# EAGLE design NodeCallerId.cg2 (EAGLE 4.16)
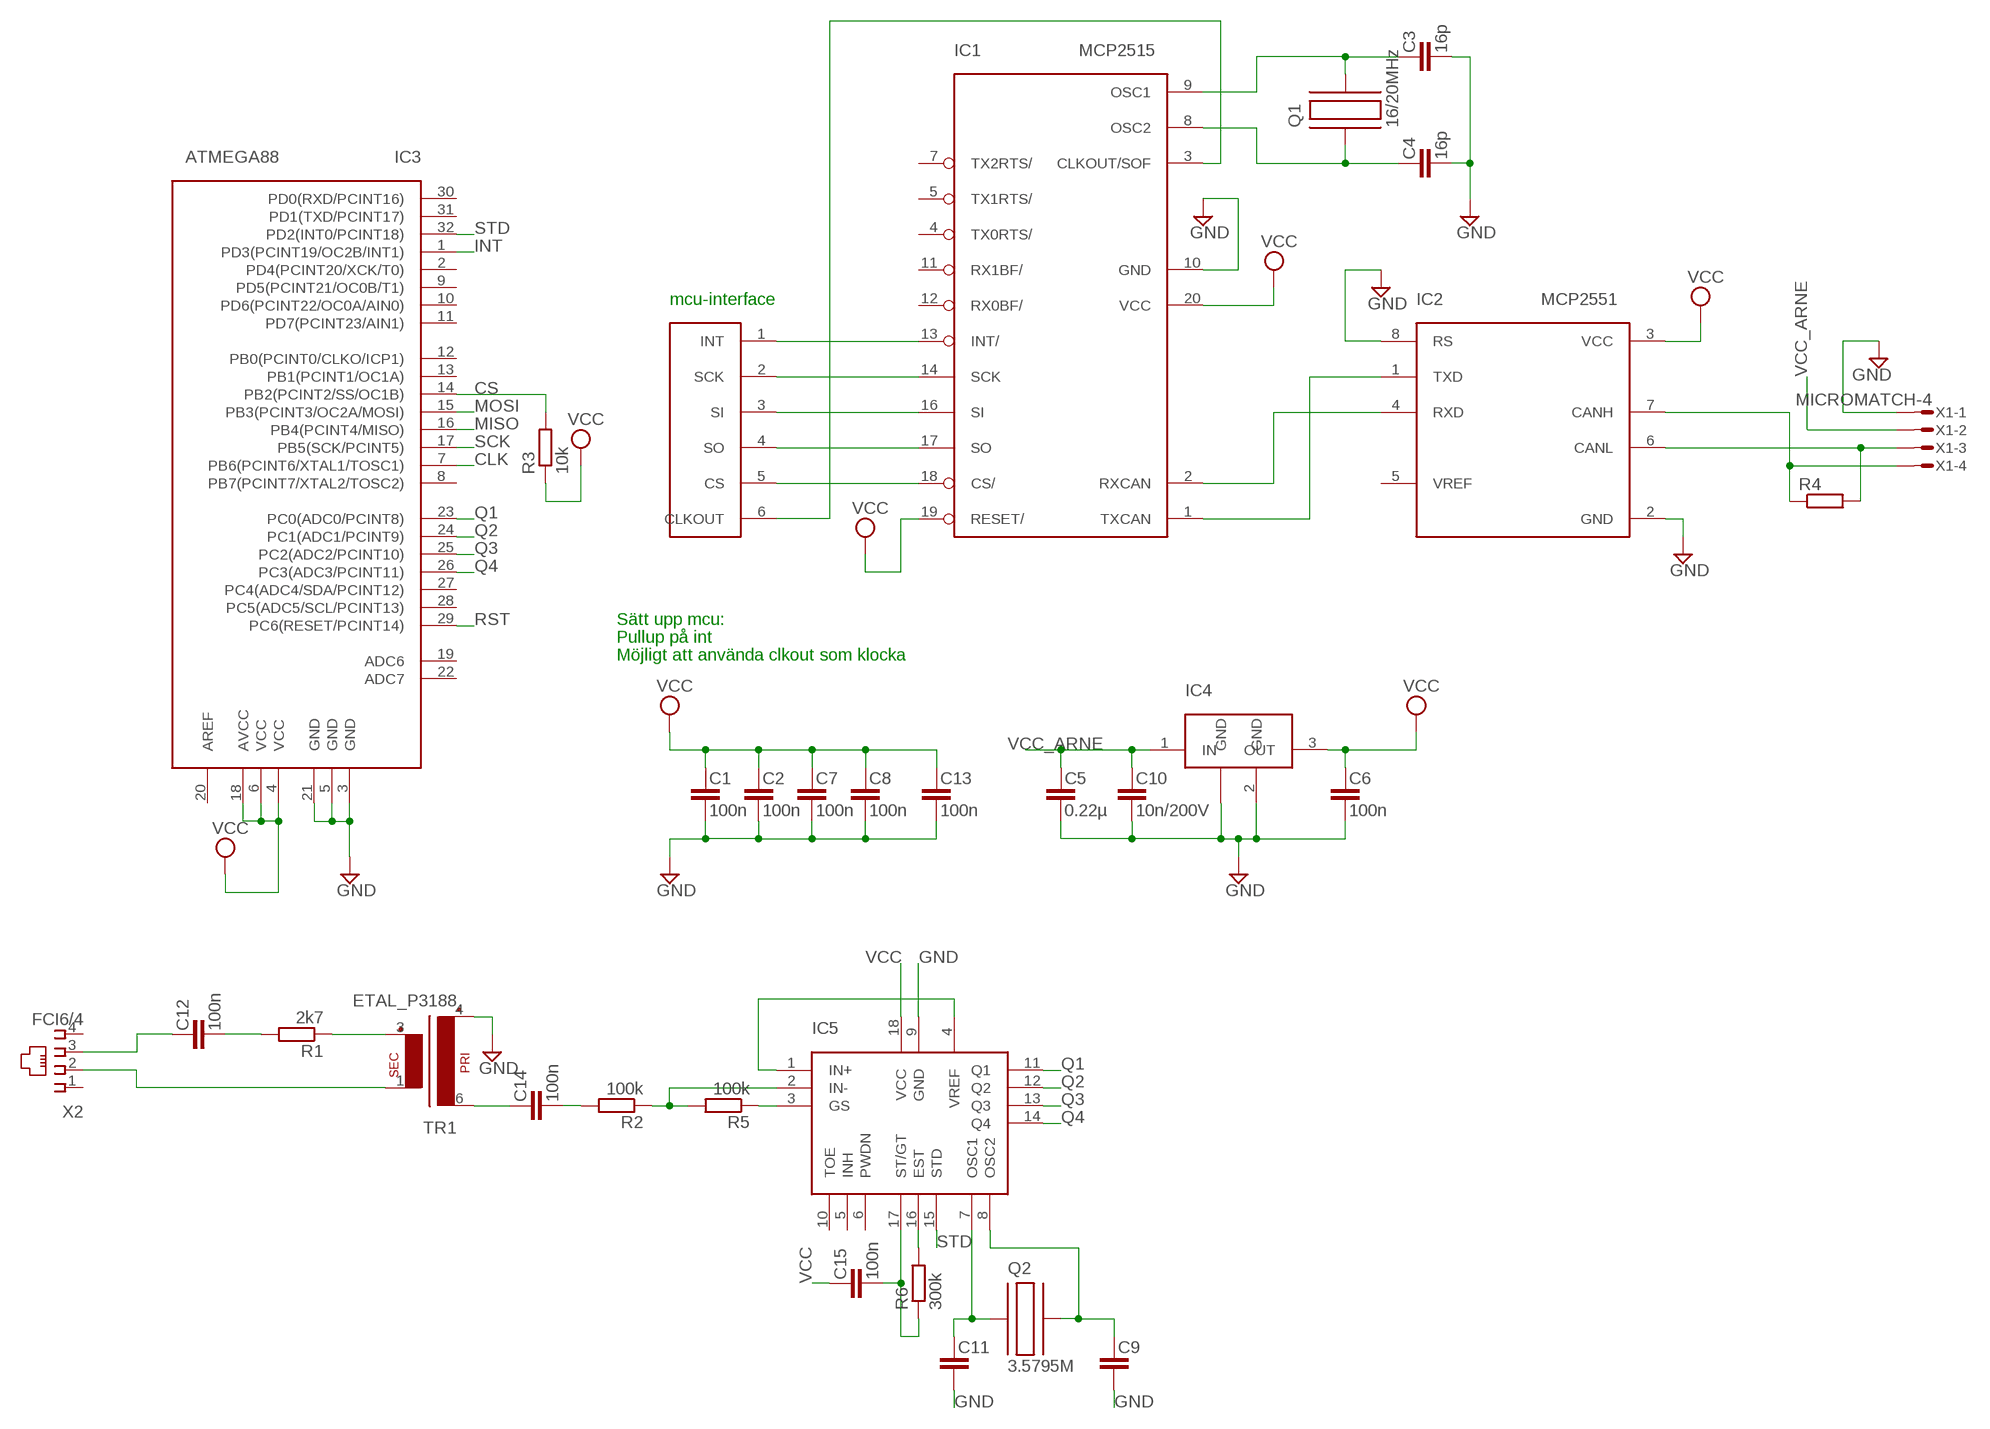
[diagram p0: schematic, sheet 1]

## Parts
C1  100n  C-EU  [C0603]
C2  100n  C-EU  [C0603]
C3  16p  C-EU  [C0603]
C4  16p  C-EU  [C0603]
C5  0.22µ  C-EU  [C0603]
C6  100n  C-EU  [C0603]
C7  100n  C-EU  [C0603]
C8  100n  C-EU  [C0603]
C9  C-EU  [C0603]
C10  10n/200V  C-EU  [C0603]
C11  C-EU  [C0603]
C12  100n  C-EU  [C0603]
C13  100n  C-EU  [C0603]
C14  100n  C-EU  [C0603]
C15  100n  C-EU  [C0603]
IC1  MCP2515  [TSSOP]
IC2  MCP2551  [SOIC]
IC3  ATMEGA88  [TQFP32]
IC4  LM340MP-5.0  [SOT223]
IC5  MT8870DIL  [DIL18]
Q1  16/20MHz  C-MAC-LFA147E  [SMD]
Q2  3.5795M  C-MAC-LFA147E  [SMD]
R1  2k7  R-EUR0603  [R0603]
R2  100k  R-EUR0603  [R0603]
R3  10k  R-EUR0603  [R0603]
R4  R-EUR0603  [R0603]
R5  100k  R-EUR0603  [R0603]
R6  300k  R-EUR0603  [R0603]
TR1  ETAL_P3188  [ETAL_P3188]
U$1  CAN-INTERFACE  [VIA-LIST]
X1  MICROMATCH-4  [MICROMATCH-4]
X2  FCI6/4  [FCI6/4]

## Nets
CANH: IC2.7(CANH) R4.1 X1.4
CANL: IC2.6(CANL) R4.2 X1.3
CLK: IC1.3(CLKOUT/SOF) IC3.7(PB6(PCINT6/XTAL1/TOSC1)) U$1.6(CLKOUT)
CS: IC1.18(CS/) IC3.14(PB2(PCINT2/SS/OC1B)) R3.2 U$1.5(CS)
GND: C1.2 C2.2 C3.2 C4.2 C5.2 C6.2 C7.2 C8.2 C9.2 C10.2 C11.2 C13.2 IC1.10(GND) IC2.2(GND) IC2.8(RS) IC3.3(GND) IC3.5(GND) IC3.21(GND) IC4.2(GND) IC4.4(GND) IC5.9(GND) TR1.4 X1.1
INT: IC1.13(INT/) IC3.1(PD3(PCINT19/OC2B/INT1)) U$1.1(INT)
MISO: IC1.17(SO) IC3.16(PB4(PCINT4/MISO)) U$1.4(SO)
MOSI: IC1.16(SI) IC3.15(PB3(PCINT3/OC2A/MOSI)) U$1.3(SI)
N$1: IC1.2(RXCAN) IC2.4(RXD)
N$2: IC1.1(TXCAN) IC2.1(TXD)
N$3: C11.1 IC5.7(OSC1) Q2.P$1
N$4: C9.1 IC5.8(OSC2) Q2.P$2
N$5: IC5.16(EST) R6.2
N$6: C15.2 IC5.17(ST/GT) R6.1
N$9: R1.1 TR1.3
N$10: C12.2 R1.2
N$11: C12.1 X2.3
N$12: C3.1 IC1.9(OSC1) Q1.P$2
N$13: C4.1 IC1.8(OSC2) Q1.P$1
N$14: TR1.1 X2.2
N$15: C14.1 TR1.6
N$16: C14.2 R2.2
N$17: IC5.2(IN-) R2.1 R5.2
N$18: IC5.3(GS) R5.1
N$19: IC5.1(IN+) IC5.4(VREF)
Q1: IC3.23(PC0(ADC0/PCINT8)) IC5.11(Q1)
Q2: IC3.24(PC1(ADC1/PCINT9)) IC5.12(Q2)
Q3: IC3.25(PC2(ADC2/PCINT10)) IC5.13(Q3)
Q4: IC3.26(PC3(ADC3/PCINT11)) IC5.14(Q4)
RST: IC3.29(PC6(RESET/PCINT14))
SCK: IC1.14(SCK) IC3.17(PB5(SCK/PCINT5)) U$1.2(SCK)
STD: IC3.32(PD2(INT0/PCINT18)) IC5.15(STD)
VCC: C1.1 C2.1 C6.1 C7.1 C8.1 C13.1 C15.1 IC1.19(RESET/) IC1.20(VCC) IC2.3(VCC) IC3.4(VCC) IC3.6(VCC) IC3.18(AVCC) IC4.3(OUT) IC5.18(VCC) R3.1
VCC_ARNE: C5.1 C10.1 IC4.1(IN) X1.2
Unconnected: IC1.4(TX0RTS/) IC1.5(TX1RTS/) IC1.7(TX2RTS/) IC1.11(RX1BF/) IC1.12(RX0BF/) IC2.5(VREF) IC3.2(PD4(PCINT20/XCK/T0)) IC3.8(PB7(PCINT7/XTAL2/TOSC2)) IC3.9(PD5(PCINT21/OC0B/T1)) IC3.10(PD6(PCINT22/OC0A/AIN0)) IC3.11(PD7(PCINT23/AIN1)) IC3.12(PB0(PCINT0/CLKO/ICP1)) IC3.13(PB1(PCINT1/OC1A)) IC3.19(ADC6) IC3.20(AREF) IC3.22(ADC7) IC3.27(PC4(ADC4/SDA/PCINT12)) IC3.28(PC5(ADC5/SCL/PCINT13)) IC3.30(PD0(RXD/PCINT16)) IC3.31(PD1(TXD/PCINT17)) IC5.5(INH) IC5.6(PWDN) IC5.10(TOE) X2.1 X2.4

## Notes on the sheet
- mcu-interface
- Sätt upp mcu:
- Pullup på int
- Möjligt att använda clkout som klocka

## Library data of the parts
C1-C15 = rcl:C-EU
IC1 = mcp2515:MCP2515
IC2 = mcp2551:MCP2551
IC3 = atmega88:ATMEGA88
IC4 = lm340mp:LM340MP-5.0
IC5 = mitel-mt8870:MT8870
Q1 Q2 = hc49-4h-smx:C-MAC-LFA147E
R1-R6 = rcl:R-EU
TR1 = etal_trafo:ETAL_P3188
U$1 = can-interface:CAN-INTERFACE
X1 = con-amp-micromatch:MICROMATCH-4: MicroMaTch 4 7-215464-4 / 0-215464-4 Drawing Number C-215464 DDEController.pdf
X2 = fci-modular:FCI6/4

## Board
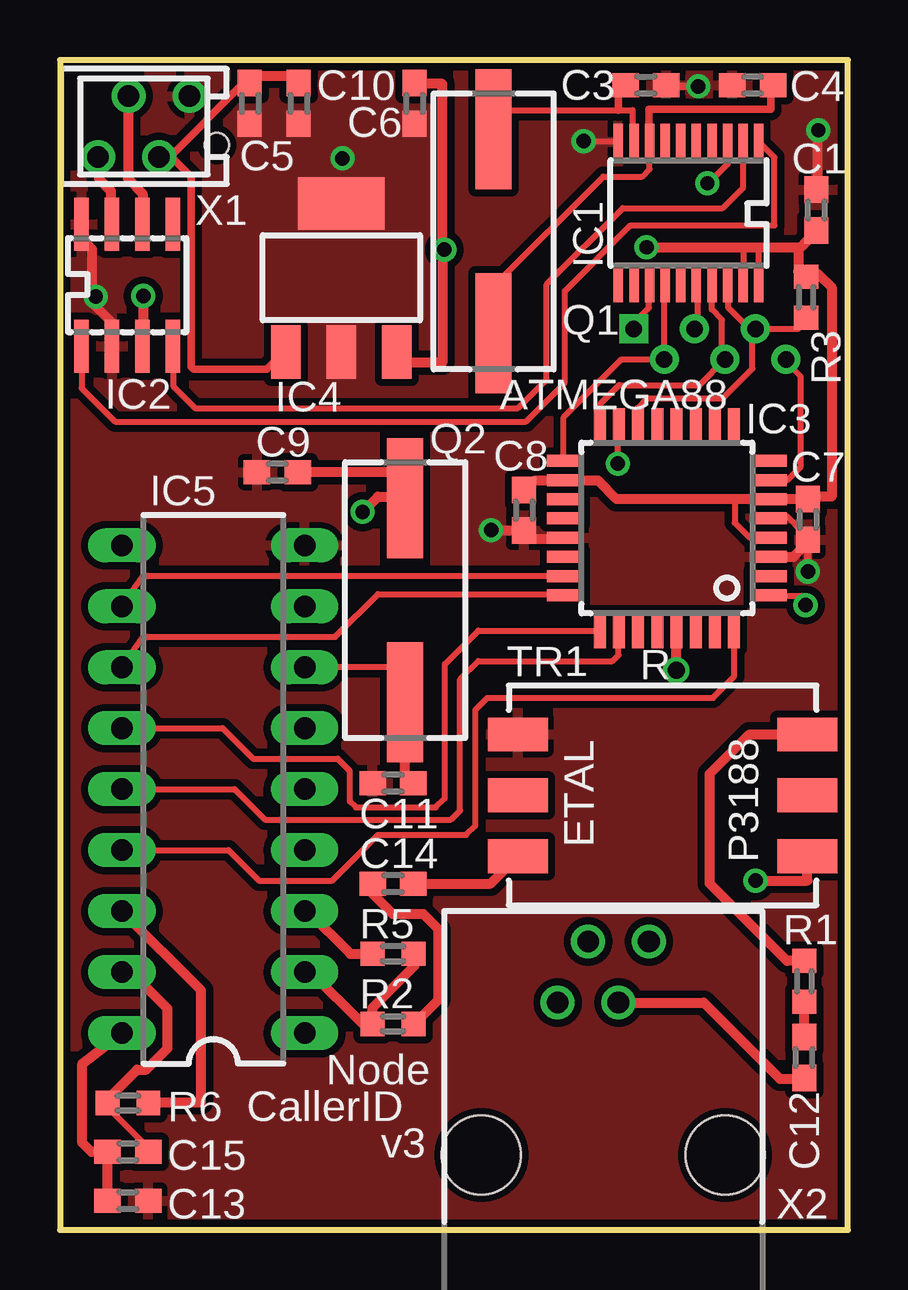
[diagram p1: board, top side]
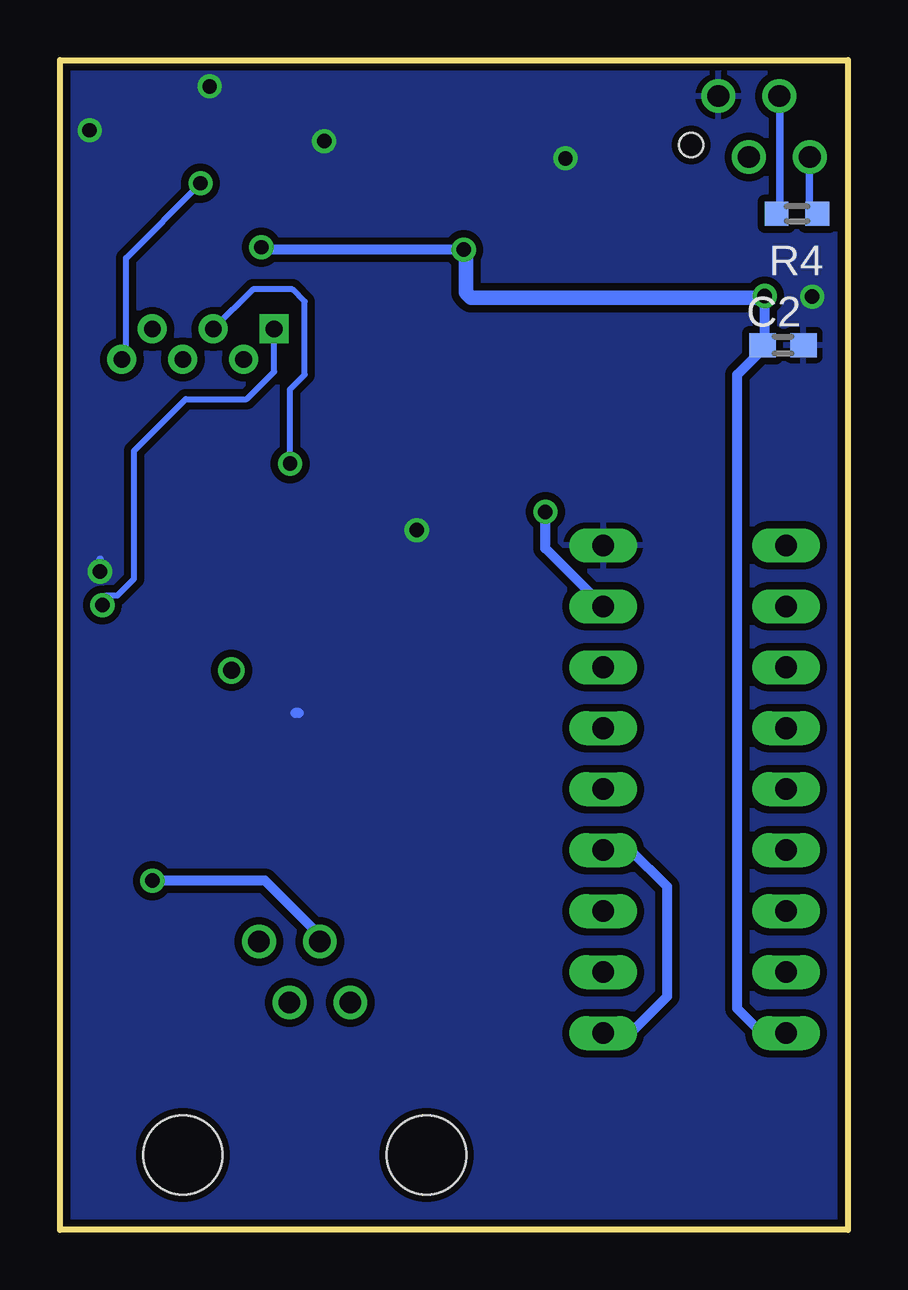
[diagram p2: board, bottom side, seen from below]

Size 32.85 x 48.75 mm. Coordinates in mm from the lower left corner, seen from the top.
Outline: 0,0 32.85,0 32.85,48.75 0,48.75 0,0
Copper layers (1*16): Top 0.035mm / dielectric 1.5mm / Bottom 0.035mm
Design rules "10mils, 0.6drill": minimum track width 10mil, minimum drill 0.6mm, track to track 10mil, track to pad 10mil, pad to pad 10mil, via to via 10mil, smd to smd 10mil, copper to edge 10mil, drill to drill 10mil, minimum pad ring 10mil, minimum via ring 8mil, stop-mask expansion 0mil, vias tented up to drill 0mil, thermal gap 10mil

### Footprints (pad centres in the part's own frame; a part is rotated, then mirrored left to right if it is on the bottom)
C0603 = smd 1.1 x 1: 1 -0.85,0; 2 0.85,0
TSSOP = smd 0.396 x 1.5: 1 -2.925,-2.975; 2 -2.275,-2.975; 3 -1.625,-2.975; 4 -0.975,-2.975; 5 -0.325,-2.975; 6 0.325,-2.975; 7 0.975,-2.975; 8 1.625,-2.975; 9 2.275,-2.975; 10 2.925,-2.975; 11 2.925,2.975; 12 2.275,2.975; 13 1.625,2.975; 14 0.975,2.975; 15 0.325,2.975; 16 -0.325,2.975; 17 -0.975,2.975; 18 -1.625,2.975; 19 -2.275,2.975; 20 -2.925,2.975
SOIC = smd 0.6 x 2.2: 1 -1.905,-2.54; 2 -0.635,-2.54; 3 0.635,-2.54; 4 1.905,-2.54; 5 1.905,2.54; 6 0.635,2.54; 7 -0.635,2.54; 8 -1.905,2.54
TQFP32 = smd 1.5 x 0.5: 1 -4.25,2.65; 2 -4.25,1.85; 3 -4.25,1.05; 4 -4.25,0.25; 5 -4.25,-0.55; 6 -4.25,-1.35; 7 -4.25,-2.15; 8 -4.25,-2.95; 17 4.25,-2.95; 18 4.25,-2.15; 19 4.25,-1.35; 20 4.25,-0.55; 21 4.25,0.25; 22 4.25,1.05; 23 4.25,1.85; 24 4.25,2.65 | smd 0.5 x 1.5: 9 -2.8,-4.4; 10 -2,-4.4; 11 -1.2,-4.4; 12 -0.4,-4.4; 13 0.4,-4.4; 14 1.2,-4.4; 15 2,-4.4; 16 2.8,-4.4; 25 2.8,4.1; 26 2,4.1; 27 1.2,4.1; 28 0.4,4.1; 29 -0.4,4.1; 30 -1.2,4.1; 31 -2,4.1; 32 -2.8,4.1
SOT223 = smd 1.219 x 2.235: 1 -2.311,-3.099; 2 0,-3.099; 3 2.311,-3.099 | smd 3.6 x 2.2: 4 0,3.099
DIL18 = drill 0.9 long: 1 -10.16,-3.81; 2 -7.62,-3.81; 3 -5.08,-3.81; 4 -2.54,-3.81; 5 0,-3.81; 6 2.54,-3.81; 7 5.08,-3.81; 8 7.62,-3.81; 9 10.16,-3.81; 10 10.16,3.81; 11 7.62,3.81; 12 5.08,3.81; 13 2.54,3.81; 14 0,3.81; 15 -2.54,3.81; 16 -5.08,3.81; 17 -7.62,3.81; 18 -10.16,3.81
SMD = smd 5 x 1.5: P$1 4.25,0; P$2 -4.25,0
R0603 = smd 0.991 x 1.016: 1 -0.85,0; 2 0.85,0
ETAL_P3188 = smd 1.4 x 2.5: 1 0,-5.08; 2 2.54,-5.08; 3 5.08,-5.08; 4 5.08,6.985; 5 2.54,6.985; 6 0,6.985
VIA-LIST = drill 0.7 square: 1 0,2.54 | drill 0.7 round: 2 -1.27,1.27; 3 0,0; 4 -1.27,-1.27; 5 0,-2.54; 6 -1.27,-3.81
MICROMATCH-4 = drill 0.9 round: 1 1.905,1.27; 2 0.635,-1.27; 3 -0.635,1.27; 4 -1.905,-1.27 | hole 1: 3.048,-0.762
FCI6/4 = drill 0.9 round: 1 -8.636,-2.794; 2 -7.366,-0.254; 3 -6.096,-2.794; 4 -4.826,-0.254 | hole 3.3: -11.811,-9.144; -1.651,-9.144

### Placement (x,y rotation side)
C1  31.54,42.49 90 top
C2  2.7,36.87 0 bottom
C3  24.43,47.7 0 top
C4  28.87,47.7 180 top
C5  7.92,46.94 270 top
C6  14.77,46.94 270 top
C7  31.17,29.61 270 top
C8  19.34,29.99 270 top
C9  9.06,31.57 180 top
C10  9.95,46.94 270 top
C11  13.88,18.62 180 top
C12  31.03,7.19 90 top
C13  2.84,1.22 0 top
C14  13.88,14.43 180 top
C15  2.84,3.25 0 top
IC1  26.21,42.37 180 top
IC2  2.8,39.37 0 top
IC3  25.3,29.1 180 top
IC4  11.73,39.67 0 top
IC5  6.39,18.37 90 top
Q1  18.08,41.61 270 top
Q2  14.39,26.24 270 top
R1  31.03,10.36 270 top
R2  13.88,8.59 0 top
R3  31.11,38.86 270 top
R4  2.12,42.34 180 bottom
R5  13.88,11.51 0 top
R6  2.84,5.28 0 top
TR1  26.08,15.57 90 top
U$1  26.46,37.54 90 top
X1  3.5,45.97 0 top
X2  29.38,12.27 0 top

### Tracks (layer width: path | path; a pad name or v marks a point on that pad's centre or on a via)
CANH
  Top 0.305: 2.12,41.95 IC2.7 | X1.4 1.62,44.7
  Top 0.406: 2.12,41.95 2.12,43.28 1.62,43.79 1.62,44.7
  Bottom 0.305: X1.4 1.62,44.7 1.62,42.69 R4.1
CANL
  Top 0.305: IC2.6 | X1.3 2.84,47.24
  Top 0.406: IC2.6 3.45,43.18 2.84,43.79 2.84,47.24
  Bottom 0.305: X1.3 2.84,47.24 2.84,42.48 R4.2
CLK  (via drill 0.6)
  Top 0.254: IC1.3 27.83,45.24 27.83,44.4 27.02,43.59 v26.99,43.61 | IC3.7 30.32,31.25 30.88,31.8 30.88,35.56 30.22,36.22 30.17,36.27
  Top 0.406: 30.17,36.17 30.22,36.22 U$1.6
  Bottom 0.254: v26.99,43.61 30.09,40.49 30.09,36.42 U$1.6
CS
  Top 0.254: IC1.18 27.83,39.52 27.86,39.52 27.86,38.43 28.87,37.41 | IC3.14 24.07,33.63 | 24.07,33.63 24.07,33.64 | 28.87,37.41 28.87,35.89 27.63,34.65 24.48,34.65 24.07,34.24 24.07,33.83 24.17,33.12 24.07,33.63 | 28.87,37.41 U$1.5 30.78,37.54 31.03,37.8 31.03,38 30.97,38 R3.2
GND  (via drill 0.6)
  Top 0.254: v21.84,45.37 23.28,45.37 IC1.10 | C1.2 31.59,43.66 | 1.34,38.63 v1.49,38.89 | 20.56,28.8 IC3.21 21.28,28.83 | C8.2 19.8,28.8 | C7.2 31.11,29.08 30.93,29.08 30.32,29.72 29.76,29.67 29.74,29.65 IC3.5 | v31.61,45.82 31.44,45.77 31.59,45.62
  Top 0.305: IC2.2 2.2,37.16 | C3.2 25.45,47.65 v26.61,47.65 | 30.93,29.08 31.16,29.08 31.18,29.06 31.18,28.55 v31.18,27.43
  Top 0.406: 2.2,37.16 2.2,37.77 1.34,38.63 1.34,40.87 0.83,41.38 IC2.8 | 19.8,28.8 20.56,28.8 | 31.59,43.66 31.59,45.62 | 31.18,28.55 31.08,28.55 30.58,28.05 IC3.3 | C8.2 18,29.14 v17.97,29.16
  Bottom 0.305: v26.61,47.65 26.56,47.73 | v31.18,27.43 31.18,27.94
  Bottom 0.406: v17.97,29.16 18.08,29.16 | 22.9,21.54 23.03,21.54
  other vias: 11.78,44.65
  pour Bottom (isolate 0.305): 0.12,48.64 32.83,48.64 32.83,0.1 24.38,0.1 0.12,0.1
  pour Top (isolate 0.305, no thermals): 5.83,48.28 15.89,48.28 15.89,34.56 5.83,34.56
  pour Top (isolate 0.305): 0.17,48.59 32.68,48.59 32.68,0.08 0.17,0.08
INT  (via drill 0.6)
  Top 0.254: IC1.13 | IC1.13 | U$1.1 23.92,37.8 24.55,38.43 24.55,39.37 IC1.13 | IC3.1 29.48,26.45 29.46,26.42 30.01,26.47 30.07,26.42 30.95,26.42 v31.08,26.04
  Bottom 0.254: v31.08,26.04 30.9,26.44 30.45,26.44 29.76,27.13 29.76,32.46 27.6,34.62 25.06,34.62 23.92,35.76 U$1.1
MISO
  Top 0.254: IC1.17 27.18,39.46 27.17,39.45 27.17,38.35 27.6,37.92 27.6,36.53 27.73,36.4 U$1.4 26.66,35.2 23.31,35.2 22.45,34.34 22.45,33.02 22.44,33.01 22.41,33.01 | IC3.16 22.41,33.01 | 22.41,33.01 22.39,33.08
MOSI  (via drill 0.6)
  Top 0.254: IC1.16 26.53,39.52 26.51,39.5 26.51,39.27 26.58,39.19 26.58,37.67 U$1.3 | IC3.15 23.3,33.47 23.26,33.43 v23.26,31.93
  Bottom 0.254: U$1.3 26.51,37.59 | U$1.3 26.41,37.49 | v23.26,31.93 23.26,35.03 22.65,35.64 22.65,38.69 23.16,39.19 24.81,39.19 U$1.3
N$1
  Top 0.254: 4.77,36.78 4.75,36.78 IC2.4 4.71,36.81 4.74,36.78 4.74,35.13 5.63,34.24 19.09,34.24 20.29,35.43 20.29,39.4 23.46,42.57 27.63,42.57 28.48,43.43 IC1.2
N$2
  Top 0.254: IC1.1 29.79,44.69 29.79,41.86 23.79,41.86 21.05,39.12 21.05,35.31 19.42,33.68 2.3,33.68 0.91,35.08 IC2.1 | IC2.1 0.91,36.88 | IC2.1
N$3
  Top 0.254: 14.39,22.05 Q2.P$1 14.39,23.45 IC5.7 9.69,23.45 | 14.39,18.71 C11.1
  Top 0.406: 14.39,18.71 Q2.P$1
N$4  (via drill 0.6)
  Top 0.254: 14.39,31.57 Q2.P$2 14.32,30.56
  Top 0.406: 14.39,31.57 C9.1 | v12.61,29.92 13.25,30.56 14.32,30.56
  Bottom 0.406: IC5.8 12.61,28.4 v12.61,29.92
N$5
  Top 0.254: R6.2 3.69,5.32
  Top 0.406: IC5.16 5.88,9.98 5.88,5.32 3.69,5.32
N$6
  Top 0.254: 2.84,10.75 IC5.17 | 1.95,5.28 R6.1 1.99,5.2 1.95,5.16 3.69,3.42 C15.2
  Top 0.406: 1.95,5.28 1.95,5.41 3.22,6.68 3.6,6.68 4.49,7.57 4.49,9.22 2.96,10.75 2.84,10.75
N$9
  Top 0.406: R1.1 30.31,11.21 27.09,14.43 27.09,19 28.74,20.65 TR1.3
N$10
  Top 0.406: C12.2 R1.2
N$11
  Top 0.254: C12.1 31.03,6.43 30.9,6.3
  Top 0.406: X2.3 26.84,9.48 30.01,6.3 30.9,6.3
N$12
  Top 0.254: IC1.9 23.87,45.7 23.87,46.66 23.28,46.66 18.13,46.66 Q1.P$2
  Top 0.305: C3.1 23.28,47.23 23.28,46.66
N$13
  Top 0.254: Q1.P$1 18.14,39.39 22.65,43.89 24.27,43.89 24.58,44.2 24.58,45.11 24.55,45.14 24.55,45.22
  Top 0.305: IC1.8 24.55,45.22 24.55,46.69 29.63,46.69 29.63,47.74 C4.1
N$14  (via drill 0.6)
  Top 0.406: v29,14.55 31.16,14.55 TR1.1
  Bottom 0.254: X2.2 21.89,12.14
  Bottom 0.406: v29,14.55 24.3,14.55 21.89,12.14
N$15
  Top 0.406: C14.1 17.95,14.43 TR1.6
N$16
  Top 0.406: C14.2 13.04,14.01 13.88,13.16 15.15,13.16 15.79,12.52 15.79,9.6 14.77,8.59 R2.2
N$17
  Top 0.406: R5.2 14.73,11.42 14.77,11.38 14.77,11 13.04,9.26 R2.1 12.61,8.59 10.46,10.75 IC5.2
N$18
  Top 0.406: IC5.3 10.33,13.29 12.11,11.51 R5.1
N$19
  Bottom 0.254: 9.06,15.82 IC5.4 | 9.06,8.21 IC5.1
  Bottom 0.406: 9.06,15.82 7.54,14.3 7.54,9.73 9.06,8.21
Q1
  Top 0.254: IC3.23 3.47,27.26 IC5.11
Q2
  Top 0.254: IC5.12 3.47,24.72 11.47,24.72 13.25,26.49 21,26.49 IC3.24
Q3
  Top 0.254: IC5.13 6.77,20.91 8.04,19.63 11.57,19.63 12.08,19.13 12.08,17.86 12.34,17.6 15.66,17.6 16.04,17.98 16.04,23.57 17.44,24.97 22.39,24.97 22.42,25 IC3.25
Q4
  Top 0.254: IC5.14 7.28,18.37 8.55,17.09 16.3,17.09 16.68,17.48 16.68,22.94 17.44,23.7 23.03,23.7 23.28,23.95 23.28,24.84 23.3,24.86 IC3.26
RST  (via drill 0.7)
  Top 0.406: IC3.29 v25.7,23.32
SCK
  Top 0.254: IC1.14 25.23,39.49 25.19,39.45 IC1.14 25.19,39.4 U$1.2 23.41,36.27 21,33.86 21,31.98 IC3.17
STD
  Top 0.254: IC5.15 7.03,15.82 8.3,14.55 11.34,14.55 13.25,16.46 16.93,16.46 17.31,16.84 17.31,21.67 17.82,22.17 27.22,22.17 28.11,23.06 28.11,24.84 28.1,24.85 IC3.32
VCC  (via drill 0.6)
  Top 0.254: 29.81,30.45 IC3.6 29.05,30.45 | 21.28,31.22 IC3.18 | IC1.20 29.12,39.52 29.12,40.95 29.68,40.95 | IC1.19 28.48,39.46 28.49,39.45 28.49,40.95 28.49,40.97 | 30.57,41 30.78,41 30.9,40.97 | IC3.4 28.75,28.85 28.13,29.47 28.13,30.45 | 1.99,3.21 1.95,3.25 1.82,3.25
  Top 0.406: 15.95,40.84 15.95,36.13 14.08,36.13 14.08,36.83 IC4.3 | IC2.3 3.42,37.21 3.47,37.69 v3.47,38.91 | 15.95,40.84 15.95,47.76 14.83,47.76 14.77,47.7 C6.1 | v16.02,40.84 15.95,40.84 | v24.45,40.95 28.49,40.95 29.68,40.95 | 29.68,40.95 29.68,40.94 | IC3.18 20.56,31.22 19.8,31.22 C8.1 | 29.81,30.45 30.7,30.45 C7.1 31.41,30.56 32.17,30.56 32.17,39.27 31.61,39.83 30.88,39.83 | 21.28,31.22 22.45,31.22 23.21,30.45 28.13,30.45 29.05,30.45 | 29.68,40.95 30.78,40.95 | 30.78,40.95 30.9,40.95 30.9,40.97 C1.1 | 30.88,39.83 30.88,39.74 R3.1 | 30.88,39.83 30.78,39.93 30.78,40.95 | C13.1 1.99,3.21 | IC5.18 0.93,6.93 0.93,3.63 1.31,3.25 1.95,3.25 C15.1
  Bottom 0.254: C2.1 3.47,37.36
  Bottom 0.406: 3.47,37.36 3.47,38.84 v3.47,38.91 | v24.45,40.95 24.4,40.95 24.3,40.84 v16.02,40.84 | IC5.18 3.6,8.21 4.61,9.22 4.61,35.64 3.47,36.78 3.6,36.78 3.68,36.87 | 3.68,36.87 3.73,36.91 | 3.68,36.87 C2.1
  Bottom 0.61: 3.47,38.84 15.71,38.84 15.92,39.04 15.92,40.84 v16.02,40.84
VCC_ARNE
  Top 0.254: 7.88,47.75 C5.1
  Top 0.305: IC4.1 9.31,36.57 8.61,35.87 5.58,35.87 5.48,35.97 5.48,43.89 4.67,44.7 4.26,44.7 | 7.88,47.75 7.61,47.75 4.56,44.7 4.26,44.7 | 4.26,44.7 X1.2
  Top 0.406: C10.1 9.95,48.08 7.92,48.08 C5.1

### Text on the board
tPlace: R | Node | CallerID | v3